# Altium schematic sheet DisplayDrivare.SchDoc
size A4; SheetNumber: 1; SheetTotal: 2
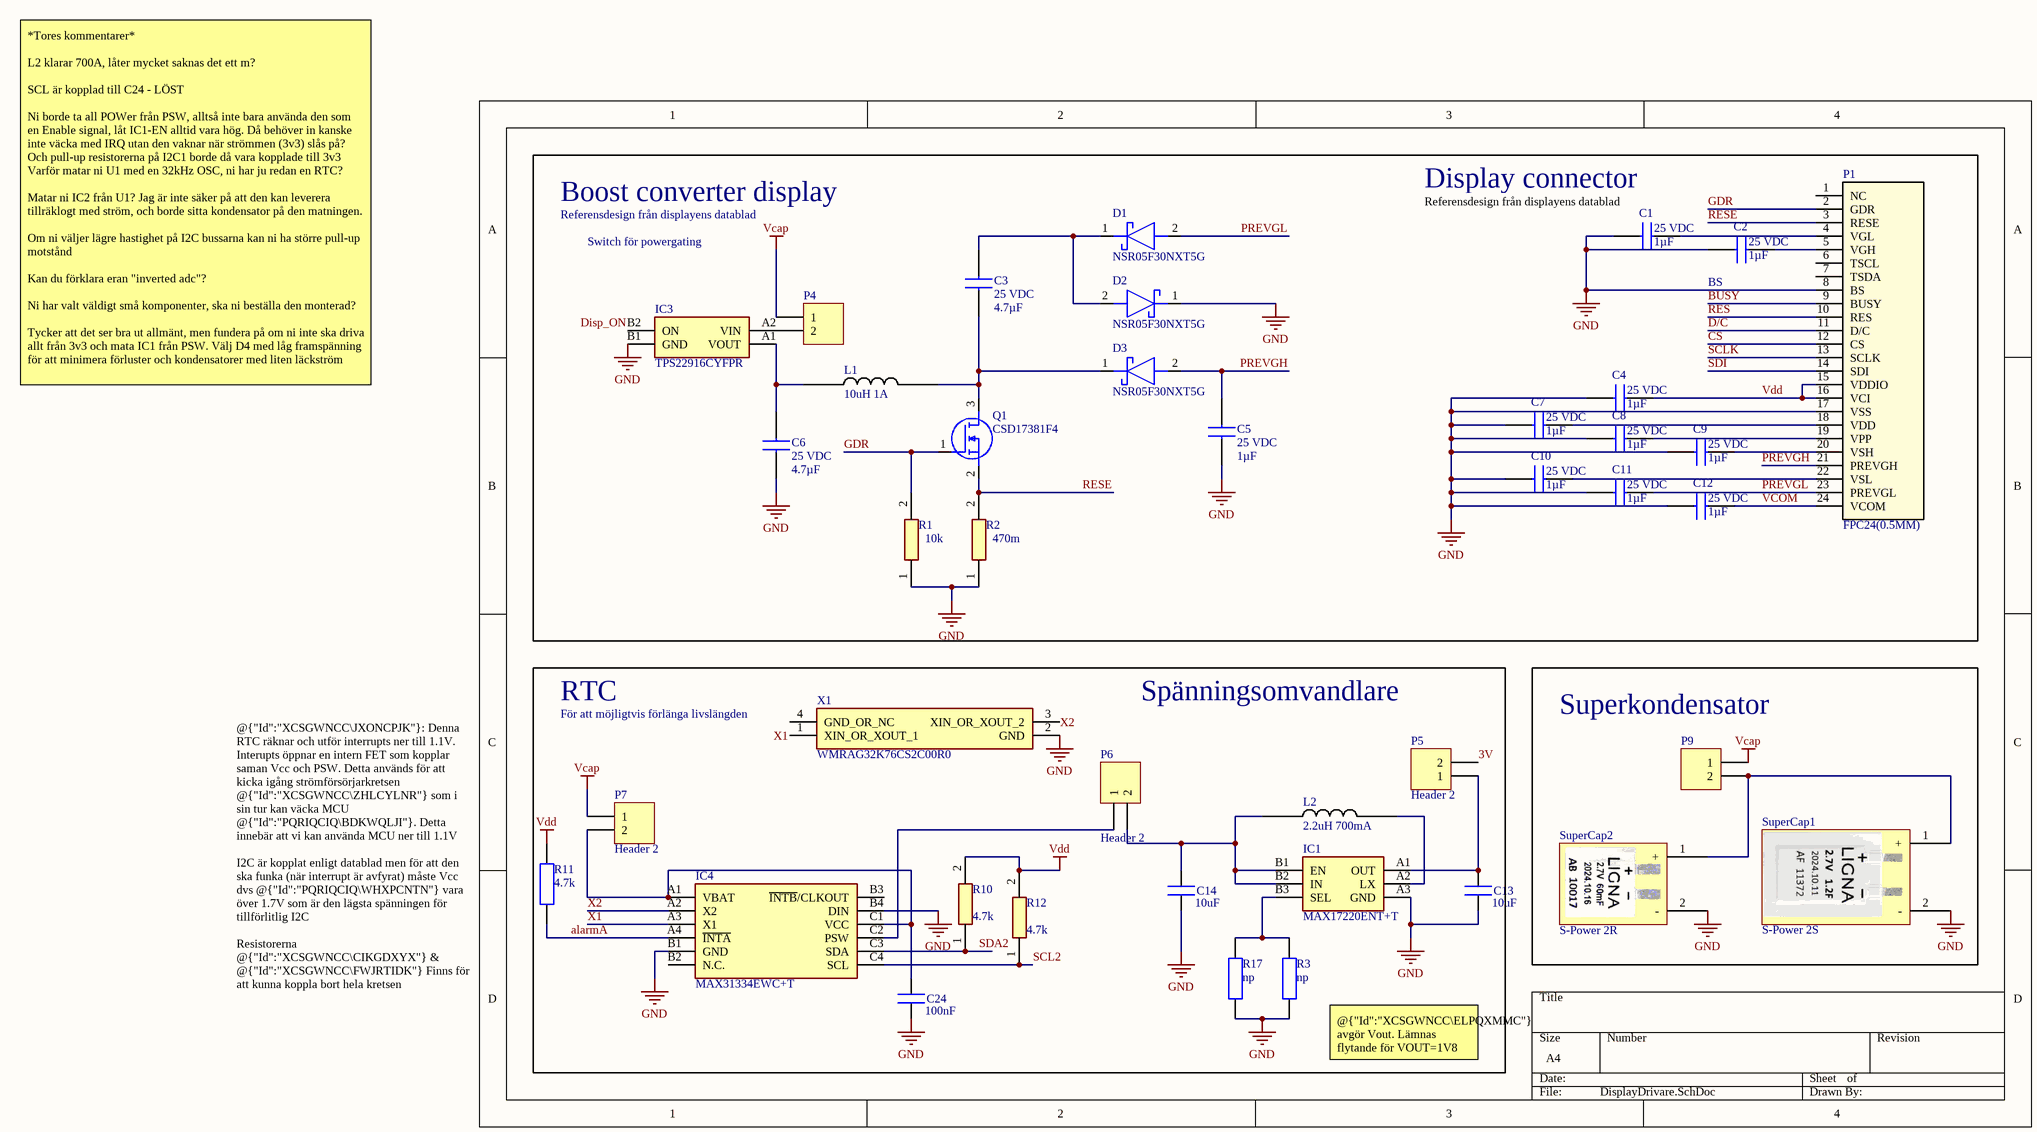
[diagram p0: DisplayDrivare.SchDoc]

## Parts
C1  value 1µF  Rated Voltage: 25 VDC  [CAPC1005X55N]  (hidden comment: GRM155R61E105KA12D)
C2  value 1µF  Rated Voltage: 25 VDC  [CAPC1005X55N]  (hidden comment: GRM155R61E105KA12D)
C3  value 4.7µF  Rated Voltage: 25 VDC  [GRM15x]  (hidden comment: GRM155C61E475ME15J)
C4  value 1µF  Rated Voltage: 25 VDC  [CAPC1005X55N]  (hidden comment: GRM155R61E105KA12D)
C5  value 1µF  Rated Voltage: 25 VDC  [CAPC1005X55N]  (hidden comment: GRM155R61E105KA12D)
C6  value 4.7µF  Rated Voltage: 25 VDC  [GRM15x]  (hidden comment: GRM155C61E475ME15J)
C7  value 1µF  Rated Voltage: 25 VDC  [CAPC1005X55N]  (hidden comment: GRM155R61E105KA12D)
C8  value 1µF  Rated Voltage: 25 VDC  [CAPC1005X55N]  (hidden comment: GRM155R61E105KA12D)
C9  value 1µF  Rated Voltage: 25 VDC  [CAPC1005X55N]  (hidden comment: GRM155R61E105KA12D)
C10  value 1µF  Rated Voltage: 25 VDC  [CAPC1005X55N]  (hidden comment: GRM155R61E105KA12D)
C11  value 1µF  Rated Voltage: 25 VDC  [CAPC1005X55N]  (hidden comment: GRM155R61E105KA12D)
C12  value 1µF  Rated Voltage: 25 VDC  [CAPC1005X55N]  (hidden comment: GRM155R61E105KA12D)
C13  capacitance: 10uF  [CAPC1005X70N]  (hidden comment: AMK105CBJ106MV-F)
C14  capacitance: 10uF  [CAPC1005X70N]  (hidden comment: AMK105CBJ106MV-F)
C24  capacitance: 100nF  [CAPC1005X70N]  (hidden comment: MCAST105SB5104KFNA01)
D1  NSR05F30NXT5G  [NSR05F30NXT5G]
D2  NSR05F30NXT5G  [NSR05F30NXT5G]
D3  NSR05F30NXT5G  [NSR05F30NXT5G]
IC1  MAX17220ENT+T  [BGA6C40P3X2_142X89X50]
IC3  TPS22916CYFPR  [BGA4C40P2X2_78X78X50]
IC4  MAX31334EWC+T  [BGA12C50P4X3_197X147X69]
L1  Rating: 10uH 1A  [INDPM4341X80N]  (hidden comment: SRP0408F-100M)
L2  Rating: 2.2uH 700mA  [WE-PMI_080562]  (hidden comment: 74479774222)
P1  FPC24(0.5MM)  [FPC24 (0.5mm)]
P4  Header 2  [HDR1X2]  (value not drawn)
P5  Header 2  [HDR1X2]
P6  Header 2  [HDR1X2]
P7  Header 2  [HDR1X2]
P9  Header 2  [HDR1X2]  (value not drawn)
Q1  CSD17381F4  [CSD17381F4]
R1  Resistance: 10k  [RESC1005X40N]  (hidden comment: CRCW040210K0FKEDHP)
R2  Resistance: 470m  [RESC2012X65N]  (hidden comment: ERJ-U6QJR47V)
R3  resistance: np  [RESC1005X40N]  (hidden comment: CRT0402-BY-80R6GLF)
R10  Resistance: 4.7k  [RESC1005X40N]  (hidden comment: CRCW04024K70FKEDHP)
R11  resistance: 4.7k  [RESC1005X40N]  (hidden comment: CRCW04024K70FKEDHP)
R12  Resistance: 4.7k  [RESC1005X40N]  (hidden comment: CRCW04024K70FKEDHP)
R17  resistance: np  [RESC1005X40N]  (hidden comment: CRT0402-BY-80R6GLF)
SuperCap1  S-Power 2S  [S-Power 2S]
SuperCap2  S-Power 2R  [S-Power 2R]
X1  WMRAG32K76CS2C00R0  [WMRAG32K76CS2C00R0]

## Blocks framed on the sheet
Superkondensator: P9 SuperCap1 SuperCap2

## Nets
GND: C1.2 C2.2 C4.2 C5.1 C6.1 C7.2 C8.2 C9.2 C10.2 C11.2 C12.2 C13.1 C14.1 C24.2 D2.1(K) IC1.A3(GND) IC3.B1(GND) IC4.B1(GND) IC4.B4(DIN) P1.8(BS) P1.17(VSS) R1.1 R2.1 R3.1 R17.1 SuperCap1.2(-) SuperCap2.2(-) X1.2(GND)
Vcap: P4.1 P7.1 P9.1
Vdd: C4.1 P1.15(VDDIO) P1.16(VCI) R10.2 R11.1 R12.2
3V: P5.2
alarmA: IC4.A4(~{INTA}) R11.2
BUSY: P1.9(BUSY)
CS: P1.12(CS)
D/C: P1.11(D/C)
Disp_ON: IC3.B2(ON)
GDR: P1.2(GDR) Q1.1(G) R1.2
PREVGH: C5.2 D3.2(A) P1.21(PREVGH)
PREVGL: C11.1 D1.2(A) P1.23(PREVGL)
RES: P1.10(RES)
RESE: P1.3(RESE) Q1.2(S) R2.2
SCL2: IC4.C4(SCL) R12.1
SCLK: P1.13(SCLK)
SDA2: IC4.C3(SDA) R10.1
SDI: P1.14(SDI)
VCOM: C12.1 P1.24(VCOM)
X1: IC4.A3(X1) X1.1(XIN_OR_XOUT_1)
X2: IC4.A2(X2) X1.3(XIN_OR_XOUT_2)
NetC1_1: C1.1 P1.4(VGL)
NetC2_1: C2.1 P1.5(VGH)
NetC3_1: C3.1 D3.1(K) L1.2 Q1.3(D)
NetC3_2: C3.2 D1.1(K) D2.2(A)
NetC6_2: C6.2 IC3.A1(VOUT) L1.1
NetC7_1: C7.1 P1.18(VDD)
NetC8_1: C8.1 P1.19(VPP)
NetC9_1: C9.1 P1.20(VSH)
NetC10_1: C10.1 P1.22(VSL)
NetC13_2: C13.2 IC1.A1(OUT) P5.1
NetC14_2: C14.2 IC1.B1(EN) IC1.B2(IN) L2.1 P6.2
NetC24_1: C24.1 IC4.A1(VBAT) IC4.C1(VCC) P7.2
NetIC1_A2: IC1.A2(LX) L2.2
NetIC1_B3: IC1.B3(SEL) R3.2 R17.2
NetIC3_A2: IC3.A2(VIN) P4.2
NetIC4_C2: IC4.C2(PSW) P6.1
NetP9_2: P9.2 SuperCap1.1(+) SuperCap2.1(+)

Not connected (* = marked no-connect by the designer): IC4 B2(N.C.) B3(~{INTB}/CLKOUT); P1 1(NC) 6(TSCL) 7(TSDA); X1 4(GND_OR_NC)

## Notes on the sheet
- Boost converter display
- (near C1) Display connector
- (near C1) Referensdesign från displayens datablad
- Referensdesign från displayens datablad
- Switch för powergating
- (near C2) BS
- *Tores kommentarer*
  L2 klarar 700A, låter mycket saknas det ett m?
  SCL är kopplad till C24 - LÖST
  Ni borde ta all POWer från PSW, alltså inte bara använda den som en Enable signal, låt IC1-EN alltid vara hög. Då behöver in kanske inte väcka med IRQ utan den vaknar när strömmen (3v3) slås på? Och pull-up resistorerna på I2C1 borde då vara kopplade till 3v3
  Varför matar ni U1 med en 32kHz OSC, ni har ju redan en RTC?
  Matar ni IC2 från U1? Jag är inte säker på att den kan leverera tillräklogt med ström, och borde sitta kondensator på den matningen.
  Om ni väljer lägre hastighet på I2C bussarna kan ni ha större pull-up motstånd
  Kan du förklara eran "inverted adc"?
  Ni har valt väldigt små komponenter, ska ni beställa den monterad?
  Tycker att det ser bra ut allmänt, men fundera på om ni inte ska driva allt från 3v3 och mata IC1 från PSW. Välj D4 med låg framspänning för att minimera förluster och kondensatorer med liten läckström
- (near X1) För att möjligtvis förlänga livslängden
- RTC
- Spänningsomvandlare
- @{"Id":"XCSGWNCC\JXONCPJK"}: Denna RTC räknar och utför interrupts ner till 1.1V. Interupts öppnar en intern FET som kopplar saman Vcc och PSW. Detta används för att kicka igång strömförsörjarkretsen @{"Id":"XCSGWNCC\ZHLCYLNR"} som i sin tur kan väcka MCU @{"Id":"PQRIQCIQ\BDKWQLJI"}. Detta innebär att vi kan använda MCU ner till 1.1V
  I2C är kopplat enligt datablad men för att den ska funka (när interrupt är avfyrat) måste Vcc dvs @{"Id":"PQRIQCIQ\WHXPCNTN"} vara över 1.7V som är den lägsta spänningen för tillförlitlig I2C
  Resistorerna @{"Id":"XCSGWNCC\CIKGDXYX"} & @{"Id":"XCSGWNCC\FWJRTIDK"} Finns för att kunna koppla bort hela kretsen
- (near R3) @{"Id":"XCSGWNCC\ELPQXMMC"} avgör Vout. Lämnas flytande för VOUT=1V8
  133kohk = > 3V

## Library data of the parts
C1 C2 C4 C5 C7-C12 = CMP-001-00126-1: Capacitor; Manufacturer_Name: Murata Electronics; Datasheet Link: https://search.murata.co.jp/Ceramy/image/img/A01X/G101/ENG/GRM155R61E105KA12-01A.pdf; Source: SamacSys.SchLib; Mouser Part Number: 81-GRM155R61E105KA2D; Arrow Part Number: GRM155R61E105KA12D; Manufacturer_Part_Number: GRM155R61E105KA12D; Design Item ID: GRM155R61E105KA12D; Arrow Price/Stock: https://www.arrow.com/en/products/grm155r61e105ka12d/murata-manufacturing?region=nac; Height: 0.55mm; Mouser Price/Stock: https://www.mouser.co.uk/ProductDetail/Murata-Electronics/GRM155R61E105KA12D?qs=hiffU4J9V6bE4a81t2Mv5A%3D%3D
C3 C6 = CMP-001-00127-1: Capacitor; Manufacturer_Name: Murata Electronics; Height: 0.5mm; Source: SamacSys.SchLib; Arrow Price/Stock: https://www.arrow.com/en/products/grm155c61e475me15j/murata-manufacturing?region=nac; Mouser Part Number: 81-GRM15C61E475ME15J; Arrow Part Number: GRM155C61E475ME15J; Manufacturer_Part_Number: GRM155C61E475ME15J; Design Item ID: GRM155C61E475ME15J; Mouser Price/Stock: https://www.mouser.co.uk/ProductDetail/Murata-Electronics/GRM155C61E475ME15J?qs=By6Nw2ByBD02p8xq06vhEQ%3D%3D; Datasheet Link: https://search.murata.co.jp/Ceramy/image/img/A01X/G101/ENG/GRM155C61E475ME15-01A.pdf
C13 C14 = Generic capacitor: Multilayer Ceramic Capacitors MLCC - SMD/SMT 4V 10uF X5R 0402 20 %; ComponentLink1Description: New link; ComponentLink1URL: https://www.mouser.se/ProductDetail/TAIYO-YUDEN/AMK105CBJ106MV-F?qs=sGAEpiMZZMsh%252B1woXyUXj0Cks%252BXuBt5iPLxjTe7mki8%3D
C24 = Generic capacitor: Multilayer Ceramic Capacitors MLCC - SMD/SMT 25V 0.1uF X5R 0402 10% Medical; ComponentLink1Description: New link; ComponentLink1URL: https://www.mouser.se/ProductDetail/TAIYO-YUDEN/MLAST105SB5104KFNA01?qs=sGAEpiMZZMsh%252B1woXyUXj3XUfju0vRpjIEu19pL458I%3D
D1-D3 = CMP-004-00034-1: Schottky Diode; Manufacturer_Name: onsemi; Arrow Part Number: NSR05F30NXT5G; Height: 0.31mm; Datasheet Link: https://www.onsemi.com/pub/Collateral/NSR05F30.PDF; Source: SamacSys.SchLib; Arrow Price/Stock: https://www.arrow.com/en/products/nsr05f30nxt5g/on-semiconductor?region=nac; Mouser Price/Stock: https://www.mouser.co.uk/ProductDetail/onsemi/NSR05F30NXT5G?qs=Ddzdinyxz%2FkBCezibUxhIA%3D%3D; Design Item ID: NSR05F30NXT5G; Mouser Part Number: 863-NSR05F30NXT5G; Manufacturer_Part_Number: NSR05F30NXT5G
IC1 = CMP-031-00089-1: MAXIM INTEGRATED PRODUCTS - MAX17220ENT+T - DC-DC Switching Step Up Regulator; Manufacturer_Name: Analog Devices; Source: SamacSys.SchLib; Arrow Part Number: MAX17220ENT+T; Design Item ID: MAX17220ENT+T; Height: 0.5mm; Datasheet Link: https://www.analog.com/MAX17220/datasheet; Arrow Price/Stock: https://www.arrow.com/en/products/max17220entt/analog-devices?region=nac; Manufacturer_Part_Number: MAX17220ENT+T; Mouser Price/Stock: https://www.mouser.co.uk/ProductDetail/Analog-Devices-Maxim-Integrated/MAX17220ENT%2bT?qs=BZBei1rCqCAO5QX%2FSv6p6w%3D%3D; Mouser Part Number: 700-MAX17220ENT+T; Supplier: Mouser; Supplier Part Number: 594-MCS04020D8062BE0
IC3 = CMP-031-00019-1: TPS22916 5.5-V; Manufacturer_Name: Texas Instruments; Manufacturer_Part_Number: TPS22916CYFPR; Source: SamacSys.SchLib; Design Item ID: TPS22916CYFPR; Mouser Part Number: 595-TPS22916CYFPR; Mouser Price/Stock: https://www.mouser.co.uk/ProductDetail/Texas-Instruments/TPS22916CYFPR?qs=EU6FO9ffTweddKR4NsfVQg%3D%3D; Datasheet Link: http://www.ti.com/lit/gpn/tps22916; Arrow Price/Stock: https://www.arrow.com/en/products/tps22916cyfpr/texas-instruments?utm_currency=USD&region=nac; Height: 0.5mm; Arrow Part Number: TPS22916CYFPR
IC4 = CMP-031-00017-1: Ultra-Low-Power Real Time Clock with Integrated Power Switch; Manufacturer_Name: Analog Devices; Source: SamacSys.SchLib; Height: 0.69mm; Manufacturer_Part_Number: MAX31334EWC+T; Datasheet Link: https://www.analog.com/MAX31334/datasheet; Mouser Price/Stock: https://www.mouser.co.uk/ProductDetail/Analog-Devices-Maxim-Integrated/MAX31334EWC%2bT?qs=vvQtp7zwQdOckJhTSGVMeA%3D%3D; Arrow Part Number: MAX31334EWC+T; Arrow Price/Stock: https://www.arrow.com/en/products/max31334ewct/analog-devices?region=nac; Mouser Part Number: 700-MAX31334EWC+T; Design Item ID: MAX31334EWC+T
L1 = CMP-006-00031-1: Power Inductors - SMD 10 UH 20%; Design Item ID: SRP0408F-100M; Source: SamacSys.SchLib
L2 = CMP-006-00060-1: Inductor-WE; Source: Schlib.SchLib; Design Item ID: 74479774222
P1 = FPC24(0.5MM): No Description Available; Mfr_Name: Molex Connector Corporation; RefDes: RefDes; Type: Type
P4-P7 P9 = CMP-002-00143-1: Header, 2-Pin; Signal Integrity: Connector; LatestRevisionNote: Re-released for DXP Platform.; Publisher: Altium Limited; Pins: 2; LatestRevisionDate: 17-Jul-2002; Design Item ID: Header 2; Component Type: Standard; Source: Miscellaneous Connectors.SchLib
Q1 = CMP-102-000001-1: MOSFET (N-Channel); Manufacturer_Name: Texas Instruments; Mouser Price/Stock: https://www.mouser.co.uk/ProductDetail/Texas-Instruments/CSD17381F4?qs=aG%252B9dtamCDf9%2FrYwJezivw%3D%3D; Design Item ID: CSD17381F4; Manufacturer_Part_Number: CSD17381F4; Mouser Part Number: 595-CSD17381F4; Source: SamacSys.SchLib; Height: 0.36mm; Datasheet Link: https://www.ti.com/lit/gpn/csd17381f4?HQS=ti-null-null-sf-df-pf-sep-wwe&DCM=yes?hkey=EF798316E3902B6ED9A73243A3159BB0
R1 = CMP-009-00221-1: CRCW Power Resistor 0402 0.063W 10K Vishay CRCW Series Thick Film Power Resistor 0402 Case 10k +/-1% 0.125W +/-100ppm/K; Manufacturer_Part_Number: CRCW040210K0FKEDHP; Design Item ID: CRCW040210K0FKEDHP; Arrow Part Number: CRCW040210K0FKEDHP; Datasheet Link: http://www.vishay.com/docs/20035/dcrcwe3.pdf; Mouser Part Number: 71-CRCW040210K0FKEDH; Height: 0.4mm; Arrow Price/Stock: https://www.arrow.com/en/products/crcw040210k0fkedhp/vishay?utm_currency=USD&region=nac; Source: SamacSys.SchLib; Manufacturer_Name: Vishay; Mouser Price/Stock: https://www.mouser.co.uk/ProductDetail/Vishay-Dale/CRCW040210K0FKEDHP?qs=FlFvgi4rxBxmIiaeyFjrkA%3D%3D
R2 = CMP-009-00220-1: Thick Film Resistors - SMD 0805 0.25W 5% .47ohms AEC-Q200; Manufacturer_Name: Panasonic; Design Item ID: ERJ-U6QJR47V; Datasheet Link: https://industrial.panasonic.com/cdbs/www-data/pdf/RDP0000/AOA0000C334.pdf; Manufacturer_Part_Number: ERJ-U6QJR47V; Mouser Price/Stock: https://www.mouser.co.uk/ProductDetail/Panasonic/ERJ-U6QJR47V?qs=5aG0NVq1C4wLyK2PwyO%252BIA%3D%3D; Height: 0.65mm; Source: SamacSys.SchLib; Mouser Part Number: 667-ERJ-U6QJR47V
R3 R17 = Generic resistor: Thin Film Resistors 1/16watts 80.6 ohm 0.10%; ComponentLink1Description: New link; ComponentLink1URL: https://www.mouser.se/ProductDetail/Bourns/CRT0402-BY-80R6GLF?qs=sGAEpiMZZMvdGkrng054tyoJODJe%252BCGW7Yc230%2FWBYo%3D
R10 R12 = CMP-009-00230-1: CRCW Power Resistor 0402 0.063W 4K7 Vishay CRCW Series Thick Film Power Resistor 0402 Case 4.7k +/-1% 0.125W +/-100ppm/K; Source: SamacSys.SchLib; Height: 0.4mm; Manufacturer_Name: Vishay; Datasheet Link: http://www.vishay.com/docs/20035/dcrcwe3.pdf; Manufacturer_Part_Number: CRCW04024K70FKEDHP; Arrow Part Number: CRCW04024K70FKEDHP; Design Item ID: CRCW04024K70FKEDHP; Mouser Price/Stock: https://www.mouser.co.uk/ProductDetail/Vishay-Dale/CRCW04024K70FKEDHP?qs=k2%2FDWSARqgH3ASlI4vM3KQ%3D%3D; Mouser Part Number: 71-CRCW04024K70FKEDH; Arrow Price/Stock: https://www.arrow.com/en/products/crcw04024k70fkedhp/vishay?utm_currency=USD&region=nac
R11 = Generic resistor: CRCW Power Resistor 0402 0.063W 4K7 Vishay CRCW Series Thick Film Power Resistor 0402 Case 4.7k +/-1% 0.125W +/-100ppm/K; ComponentLink1Description: New link; ComponentLink1URL: *
SuperCap1 = CMP-111-000002-1: Design Item ID: S-Power 2S; Source: Schlib.SchLib
SuperCap2 = CMP-111-000001-1: Design Item ID: S-Power 2R; Source: Schlib.SchLib
X1 = CMP-003-00031-1: 32.768 kHz +/-20ppm Crystal 8pF 75 kOhms 4-SMD; Manufacturer_Name: Murata Electronics; Manufacturer_Part_Number: WMRAG32K76CS2C00R0; Mouser Part Number: 81-WMRAG32K76CS2C00R; Source: SamacSys.SchLib; Height: 0.35mm; Datasheet Link: https://www.murata.com/products/productdata/8804604674078/SPEC-WMRAG32K76CS2C00R0.pdf; Design Item ID: WMRAG32K76CS2C00R0; Mouser Price/Stock: https://www.mouser.co.uk/ProductDetail/Murata-Electronics/WMRAG32K76CS2C00R0?qs=bZr6mbWTK5kWV2uyypDEfg%3D%3D